# Altium schematic sheet Power_Stage.SchDoc
size A3; SheetNumber: 1; SheetTotal: 8
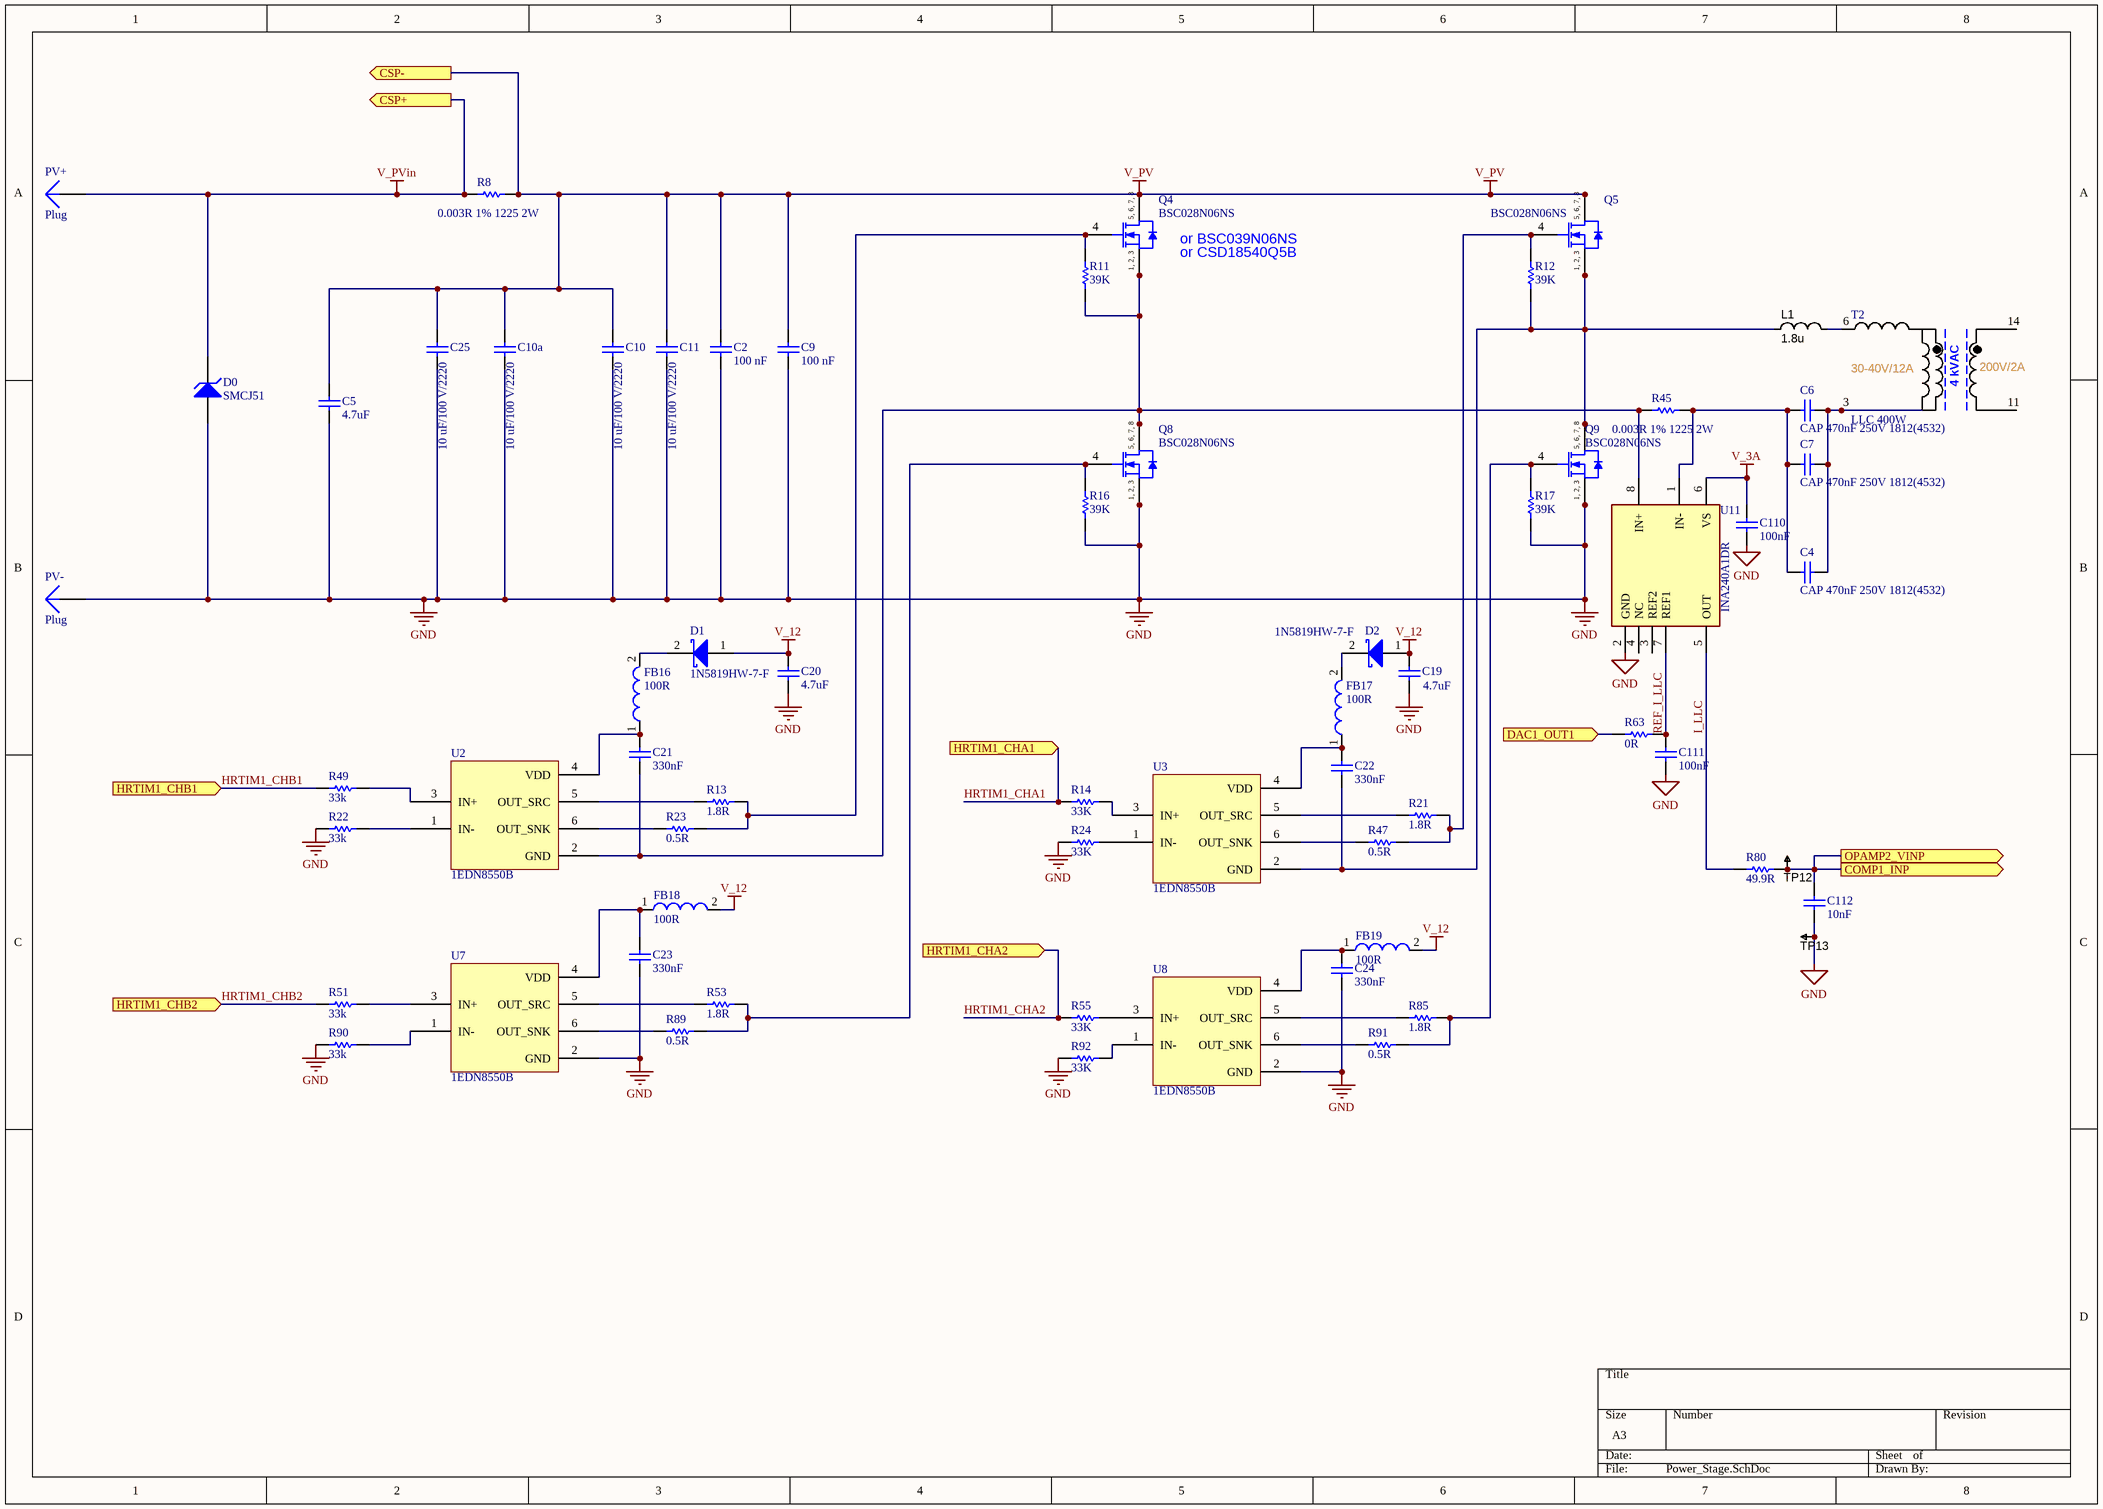
[diagram p0: Power_Stage.SchDoc]

## Parts
C2  100 nF  [CAPC2013X94X50NL20T25]
C4  CAP 470nF 250V 1812(4532)  [CAPC1812(4532)190_M]
C5  4.7uF  [CAPC3225X279X50NL20T25]
C6  CAP 470nF 250V 1812(4532)  [CAPC1812(4532)190_M]
C7  CAP 470nF 250V 1812(4532)  [CAPC1812(4532)190_M]
C9  100 nF  [CAPC2013X94X50NL20T25]
C10  10 uF/100 V/2220  [CAPC5750X279X64LL40T39]
C10a  10 uF/100 V/2220  [CAPC5750X279X64LL40T39]
C11  10 uF/100 V/2220  [CAPC5750X279X64LL40T39]
C19  Capacitance: 4.7uF  [CAPC3216X180X50ML20T25]  (hidden comment: C1206C105K3RACTU)
C20  Capacitance: 4.7uF  [CAPC3216X180X50ML20T25]  (hidden comment: C1206C105K3RACTU)
C21  330nF  [CAPC2013X135X45ML10T25]
C22  330nF  [CAPC2013X135X45ML10T25]
C23  330nF  [CAPC2013X135X45ML10T25]
C24  330nF  [CAPC2013X135X45ML10T25]
C25  10 uF/100 V/2220  [CAPC5750X279X64LL40T39]
C110  100nF  [CAPC1608X90X35NL10T15]
C111  100nF  [CAPC1608X90X35NL10T15]
C112  10nF  [CAPC1005X56X25NL10T15]
D0  SMCJ51  [FAIR-DO-214AB-2_V]
D1  1N5819HW-7-F  [DIOD-SOD-123-2_V]
D2  1N5819HW-7-F  [DIOD-SOD-123-2_V]
FB16  100R  [SMD-0603]
FB17  100R  [SMD-0603]
FB18  100R  [SMD-0603]
FB19  100R  [SMD-0603]
L1  1.8u  [IND LLC]
PV+  Plug  [PV_PAD]
PV-  Plug  [PV_PAD]
Q4  BSC028N06NS  [INF-PG-TDSON-8-1_V]
Q5  BSC028N06NS  [INF-PG-TDSON-8-1_V]
Q8  BSC028N06NS  [INF-PG-TDSON-8-1_V]
Q9  BSC028N06NS  [INF-PG-TDSON-8-1_V]
R8  0.003R 1% 1225 2W  [RESC3264X06N]
R11  39K  [RESC1608X55X30NL20T10]
R12  39K  [RESC1608X55X30NL20T10]
R13  1.8R  [RESC3216X70X40ML20T20]
R14  33K  [RESC1608X55X25ML10T15]
R16  39K  [RESC1608X55X30NL20T10]
R17  39K  [RESC1608X55X30NL20T10]
R21  1.8R  [RESC3216X70X40ML20T20]
R22  33k  [RESC1608X55X25ML10T15]
R23  0.5R  [RESC3216X70X40ML20T20]
R24  33K  [RESC1608X55X25ML10T15]
R45  0.003R 1% 1225 2W  [RESC3264X06N]
R47  0.5R  [RESC3216X70X40ML20T20]
R49  33k  [RESC1608X55X25ML10T15]
R51  33k  [RESC1608X55X25ML10T15]
R53  1.8R  [RESC3216X70X40ML20T20]
R55  33K  [RESC1608X55X25ML10T15]
R63  0R  [RESC1608X55X25ML10T15]
R80  49.9R  [RESC1608X55X30ML15T15]
R85  1.8R  [RESC3216X70X40ML20T20]
R89  0.5R  [RESC3216X70X40ML20T20]
R90  33k  [RESC1608X55X25ML10T15]
R91  0.5R  [RESC3216X70X40ML20T20]
R92  33K  [RESC1608X55X25ML10T15]
T2  LLC 400W  [ETD39-K-V-16P-HORIZONTAL-PRI]
TP12  TESTPOINT  [TP-R60]  (value not drawn)  (no BOM)
TP13  TESTPOINT  [TP-R60]  (value not drawn)  (no BOM)
U2  1EDN8550B  [SOT23-6]
U3  1EDN8550B  [SOT23-6]
U7  1EDN8550B  [SOT23-6]
U8  1EDN8550B  [SOT23-6]
U11  INA240A1DR  [SOIC127P600X175-8AN]

## Ports
COMP1_INP (out), CSP+ (out), CSP- (out), DAC1_OUT1 (in), HRTIM1_CHA1 (in), HRTIM1_CHA2 (in), HRTIM1_CHB1 (in), HRTIM1_CHB2 (in), OPAMP2_VINP (out)

## Nets
GND: C2.1 C5.1 C9.1 C10.1 C10a.1 C11.1 C19.1 C20.1 C23.1 C24.1 C25.1 C110.1 C111.1 C112.1 D0.1(A) PV-.1 Q8.1(SOURCE) Q8.2(SOURCE) Q8.3(SOURCE) Q9.1(SOURCE) Q9.2(SOURCE) Q9.3(SOURCE) R16.1 R17.1 R22.1 R24.1 R90.1 R92.1 TP13.1 U7.2(GND) U8.2(GND) U11.2(GND)
V_3A: C110.2 U11.6(VS)
V_12: C19.2 C20.2 D1.1(A) D2.1(A) FB18.2 FB19.2
V_PV: C2.2 C5.2 C9.2 C10.2 C10a.2 C11.2 C25.2 Q4.5(DRAIN) Q4.6(DRAIN) Q4.7(DRAIN) Q4.8(DRAIN) Q5.5(DRAIN) Q5.6(DRAIN) Q5.7(DRAIN) Q5.8(DRAIN) R8.2 ; port CSP-
V_PVin: D0.2(K) PV+.1 R8.1 ; port CSP+
COMP1_INP: C112.2 R80.2 TP12.1 ; port OPAMP2_VINP, port COMP1_INP
DAC1_OUT1: R63.1 ; port DAC1_OUT1
HRTIM1_CHA1: R14.1 ; port HRTIM1_CHA1
HRTIM1_CHA2: R55.1 ; port HRTIM1_CHA2
HRTIM1_CHB1: R49.1 ; port HRTIM1_CHB1
HRTIM1_CHB2: R51.1 ; port HRTIM1_CHB2
I_LLC: R80.1 U11.5(OUT)
REF_I_LLC: C111.2 R63.2 U11.7(REF1)
NetC4_1: C4.1 C6.1 C7.1 R45.2 U11.1(IN-)
NetC4_2: C4.2 C6.2 C7.2 T2.3
NetC21_1: C21.1 Q4.1(SOURCE) Q4.2(SOURCE) Q4.3(SOURCE) Q8.5(DRAIN) Q8.6(DRAIN) Q8.7(DRAIN) Q8.8(DRAIN) R11.1 R45.1 U2.2(GND) U11.8(IN+)
NetC21_2: C21.2 FB16.1 U2.4(VDD)
NetC22_1: C22.1 L1.1 Q5.1(SOURCE) Q5.2(SOURCE) Q5.3(SOURCE) Q9.5(DRAIN) Q9.6(DRAIN) Q9.7(DRAIN) Q9.8(DRAIN) R12.1 U3.2(GND)
NetC22_2: C22.2 FB17.1 U3.4(VDD)
NetC23_2: C23.2 FB18.1 U7.4(VDD)
NetC24_2: C24.2 FB19.1 U8.4(VDD)
NetD1_2: D1.2(K) FB16.2
NetD2_2: D2.2(K) FB17.2
NetL1_2: L1.2 T2.6
NetQ4_4: Q4.4(GATE) R11.2 R13.2 R23.2
NetQ5_4: Q5.4(GATE) R12.2 R21.2 R47.2
NetQ8_4: Q8.4(GATE) R16.2 R53.2 R89.2
NetQ9_4: Q9.4(GATE) R17.2 R85.2 R91.2
NetR13_1: R13.1 U2.5(OUT_SRC)
NetR14_2: R14.2 U3.3(IN+)
NetR21_1: R21.1 U3.5(OUT_SRC)
NetR22_2: R22.2 U2.1(IN-)
NetR23_1: R23.1 U2.6(OUT_SNK)
NetR24_2: R24.2 U3.1(IN-)
NetR47_1: R47.1 U3.6(OUT_SNK)
NetR49_2: R49.2 U2.3(IN+)
NetR51_2: R51.2 U7.3(IN+)
NetR53_1: R53.1 U7.5(OUT_SRC)
NetR55_2: R55.2 U8.3(IN+)
NetR85_1: R85.1 U8.5(OUT_SRC)
NetR89_1: R89.1 U7.6(OUT_SNK)
NetR90_2: R90.2 U7.1(IN-)
NetR91_1: R91.1 U8.6(OUT_SNK)
NetR92_2: R92.2 U8.1(IN-)

Not connected (* = marked no-connect by the designer): T2 11 14; U11 3(REF2) 4(NC)

## Notes on the sheet
- (near Q4) or BSC039N06NS
- (near Q4) or CSD18540Q5B
- (in symbol CMP-1091-00043-1) 5, 6, 7, 8; 1, 2, 3
- (in symbol TI-ETD39-200V-2A-LLC) 30-40V/12A; 200V/2A; 4 kVAC

## Library data of the parts
C2 C9 = CMP-1036-04427-2: X7R 100nF ±10% 100V 0805 Multilayer Ceramic Capacitors MLCC - SMD/SMT ROHS; Manufacturer: AVX Interconnect / Elco; Part Number: 08051C104JAT2A; Manufacturer Part Number: CL21B104KCFNNNE; Tolerance: 5%; Dissipation Factor: 2.5%; Supplier 1: RSComponents; Supplier Part Number 1: 1356664; RoHS: Yes; Category: Ceramic Capacitors; Stock 1: 1; Pricing 1: 100=0.13700, 500=0.12500, 1000=0.11100 (USD); Mount: Surface Mount; Case/Package: 0805; Number of Pins: 2; Case Code (Metric): 2012; Case Code (Imperial): 0805; Min Operating Temperature: -55°C; Max Operating Temperature: 125°C; Package Quantity: 1; Capacitance: 100nF; Voltage Rating: 100V; Packaging: Tape and Reel; Voltage Rating (DC): 100V; Dielectric: X7R; Series: -; Termination: SMD/SMT; Construction: Flat; Voltage: 100V; Length: 2.01mm; Width: 0.049inch; Height: 1.4mm; Thickness: 0.055inch; Depth: 1.25mm; Radiation Hardening: No; RoHS Compliant: Yes; REACH SVHC: No SVHC; Lead Free: Lead Free; ComponentLink1URL: https://datasheet.ciiva.com/152/cx7r-152288.pdf?src-supplier=Digi-Key; ComponentLink1Description: https://datasheet.ciiva.com/152/cx7r-152288.pdf?src-supplier=Digi-Key; ComponentLink2URL: https://datasheet.ciiva.com/152/cx7r-152289.pdf?src-supplier=Digi-Key; ComponentLink2Description: https://datasheet.ciiva.com/152/cx7r-152289.pdf?src-supplier=Digi-Key; ComponentLink3URL: https://datasheet.ciiva.com/11504/cx7r-11504232.pdf?src-supplier=Avnet; ComponentLink3Description: https://datasheet.ciiva.com/11504/cx7r-11504232.pdf?src-supplier=Avnet; ComponentLink4URL: https://datasheet.ciiva.com/16326/cx7r-16326744.pdf?src-supplier=Future+Electronics; ComponentLink4Description: https://datasheet.ciiva.com/16326/cx7r-16326744.pdf?src-supplier=Future+Electronics; ComponentLink5URL: https://datasheet.ciiva.com/22676/1679506-22676600.pdf?src-supplier=Element14; ComponentLink5Description: https://datasheet.ciiva.com/22676/1679506-22676600.pdf?src-supplier=Element14; ComponentLink6URL: https://datasheet.ciiva.com/5427/cx7r-218113-5427354.pdf?src-supplier=Mouser; ComponentLink6Description: https://datasheet.ciiva.com/5427/cx7r-218113-5427354.pdf?src-supplier=Mouser; ComponentLink7URL: https://datasheet.ciiva.com/16625/cx7r-16625228.pdf?src-supplier=Avnet+Europe; ComponentLink7Description: https://datasheet.ciiva.com/16625/cx7r-16625228.pdf?src-supplier=Avnet+Europe; ComponentLink8URL: https://datasheet.ciiva.com/152/cx7r-152287.pdf?src-supplier=Digi-Key; ComponentLink8Description: https://datasheet.ciiva.com/152/cx7r-152287.pdf?src-supplier=Digi-Key; ComponentLink9URL: https://datasheet.ciiva.com/28613/1679506-28613087.pdf?src-supplier=Element14; ComponentLink9Description: https://datasheet.ciiva.com/28613/1679506-28613087.pdf?src-supplier=Element14; JLCPCB Part #: C28233; Parameter 1: *
C4 C6 C7 = CMP-1040-01559-1: CAP 470nF 250V ±10% 1812 (4532 Metric) Thickness 1.9mm SMD; Case-Metric: 4532; Case-EIA: 1812; Tolerance: Â±10%; Max Thickness: 1.9 mm; Technology: SMT; Rated Voltage: 250 V; Value: 470nF; Parameter 1: *; JLCPCB Part #: *
C5 = CMP-2000-05478-1: Ceramic Capacitor, 100 V, 4.7 uF, +/-10%, -55 to 85 degC, 2-Pin SMD (1210), RoHS, Tape and Reel; Temperature Coefficient / Code: +/-15%; Case Height: 2.79mm; Brand: AVX; Case Width: 2.5mm; Tolerance: 10%; Capacitance: 22uF; Voltage Rating: 25V; Dielectric: X5R; Case Length: 3.2mm; Type: StandardX5RMLCCs; Case Code - in: 1210; Packaging: Reel; Minimum Operating Temperature: -55C; Package Reference: 1210; Product Category: MultilayerCeramicCapacitorsMLCC-SMD/SMT; Package / Case: 1210(3225metric); Dimensions: 2.5mmWx3.2mmLx2.79mmH; RoHS: Details; Manufacturer: AVX; Case Code - mm: 3225; Maximum Operating Temperature: +85C; Operating Temperature Range: -55Cto+85C; Mounting Technology: SurfaceMount; Product: GeneralTypeMLCCs; Manufacturer URL: http://www.avx.com/; Termination Style: SMD/SMT; Package Description: 2-Pin Surface Mount Device, Body 3.2 x 2.5 mm; Datasheet URL: http://datasheets.avx.com/cx5r.pdf; Datasheet Version: 05/2016; Voltage Rating DC: 25V; Factory Pack Quantity: 1000; Parameter 1: *; JLCPCB Part #: *
C10 C10a C11 C25 = CMP-2000-07534-1: Chip Capacitor, 10 uF, +/- 20%, 100 V, -55 to 125 degC, 2220 (5750 Metric), RoHS, Tape and Reel; Manufacturer: AVX; Manufacturer Part Number: 22201C106MAT2A; Capacitance: 10uF; Voltage Rating: 100V; Dielectric: X7R; Datasheet URL: http://datasheets.avx.com/X7RDielectric.pdf; Package Reference: 2220; Package Description: 2-Pin Surface Mount Device, Body 5 x 5.7 mm; Datasheet Version: 03/2017; Manufacturer URL: http://www.avx.com/; Mounting Technology: SurfaceMount; Supplier 1: Digi-Key; Supplier Part Number 1: 478-9622-1-ND; Stock 1: 129916; Pricing 1: 1=2,26000, 10=1,82600, 100=1,39470 (USD); RoHS: Yes; Mount: Surface Mount; Case/Package: 2220; Case Code (Metric): 5750; Case Code (Imperial): 2220; Min Operating Temperature: -55°C; Max Operating Temperature: 125°C; Packaging: Tape and Reel; Tolerance: 20%; Voltage Rating (DC): 100V; Length: 0.224inch; Width: 0.197inch; Thickness: 0.11inch; ComponentLink1URL: http://catalogs.avx.com/SurfaceMount.pdf?src-supplier=Digi-Key; ComponentLink1Description: http://catalogs.avx.com/SurfaceMount.pdf?src-supplier=Digi-Key; Parameter 1: *; JLCPCB Part #: *
C19 C20 = CMP-2000-04991-1: X7R ±10% 50V 4.7uF 1206 Multilayer Ceramic Capacitors MLCC - SMD/SMT ROHS; Manufacturer: Kemet; Temperature Coefficient / Code: +/-15%; Voltage Rating DC: 25V; Capacitance - nF: 1000nF; Class: Class1; Case Length: 3.2mm; Type: SMDMLCCX7R6.3-250VDCCommericalGrade; Case Width: 1.6mm; Product: GeneralTypeMLCCs; Dielectric: X7R; Datasheet URL: https://ciiva.com/datasheet-click-18194173?src=ciiva&sig=6daff8c4; Operating Temperature Range: -55Cto+125C; Series: C1206C; RoHS: Details; Product Category: MultilayerCeramicCapacitorsMLCC-SMD/SMT; Manufacturer URL: http://www.kemet.com/; Minimum Operating Temperature: -55C; Dimensions: 1.6mmWx3.2mmLx1.6mmH; Termination Style: SMD/SMT; Brand: Kemet; Packaging: Reel; Package / Case: 1206(3216metric); Case Code - mm: 3216; Datasheet Version: Jul-14; Factory Pack Quantity: 2000; Package Description: 2-Pin Surface Mount Device, Body 3.2 x 1.6 mm; Tolerance: 10%; Package Reference: 1206; Case Height: 1.6mm; Case Code - in: 1206; Maximum Operating Temperature: +125C; Voltage Rating: 25V; Parameter 1: *; JLCPCB Part #: C29823
C21-C24 = CMP-2100-03644-1: X7R ±10% 50V 330nF 0805 Multilayer Ceramic Capacitors MLCC - SMD/SMT ROHS; Manufacturer: Murata; Manufacturer Part Number: GRM21BR71H104KA01L; Capacitance: 100nF; Insulation Resistance: 10GR; Package Description: 2-Pin Surface Mount Device, Body 2 x 1.25 mm; Manufacturer URL: http://www.murata.com/; Case Code (Imperial): 0805; Voltage: 50V; Datasheet URL: http://psearch.en.murata.com/capacitor/product/GRM21BR71H104KA01%23.pdf; Termination: SMD/SMT; Lead Free: LeadFree; Package Quantity: 1; Mount: SurfaceMount; REACH SVHC: Unknown; Thickness: 0.053inch; Height: 1.25mm; Case/Package: 0805; Voltage Rating: 50V; Dielectric Material: Ceramic; Width: 0.049inch; Case Code (Metric): 2012; Material: Ceramic; Min Operating Temperature: -55degC; RoHSCompliant: true; Datasheet Version: 42675.0; Voltage Rating (DC): 50V; Tolerance: 10%; Dielectric: X7R; Package Reference: 0805; Depth: 1.25mm; Length: 2mm; Max Operating Temperature: 125degC; Packaging: TapeandReel; Number of Pins: 2; Radiation Hardening: No; Supplier 1: Farnell; Supplier Part Number 1: 2408531; RoHS: Yes; Category: Ceramic Capacitors; Stock 1: 576000; ComponentLink1URL: https://datasheet.ciiva.com/11786/0900766b8003061f-11786305.pdf?src-supplier=RSComponents; ComponentLink1Description: https://datasheet.ciiva.com/11786/0900766b8003061f-11786305.pdf?src-supplier=RSComponents; ComponentLink2URL: https://datasheet.ciiva.com/20173/71-2024-20173169.pdf?src-supplier=Rapid+Electronics; ComponentLink2Description: https://datasheet.ciiva.com/20173/71-2024-20173169.pdf?src-supplier=Rapid+Electronics; ComponentLink3URL: https://datasheet.ciiva.com/29200/453120-da-01-en-vs-kondensator-0805-29200537.pdf?src-supplier=Conrad; ComponentLink3Description: https://datasheet.ciiva.com/29200/453120-da-01-en-vs-kondensator-0805-29200537.pdf?src-supplier=Conrad; ComponentLink4URL: https://datasheet.ciiva.com/132/partnumbering-e-01-132209.pdf?src-supplier=Digi-Key; ComponentLink4Description: https://datasheet.ciiva.com/132/partnumbering-e-01-132209.pdf?src-supplier=Digi-Key; ComponentLink5URL: https://datasheet.ciiva.com/132/partnumbering-e-01-132210.pdf?src-supplier=Digi-Key; ComponentLink5Description: https://datasheet.ciiva.com/132/partnumbering-e-01-132210.pdf?src-supplier=Digi-Key; ComponentLink6URL: https://datasheet.ciiva.com/132/partnumbering-e-01-132211.pdf?src-supplier=Digi-Key; ComponentLink6Description: https://datasheet.ciiva.com/132/partnumbering-e-01-132211.pdf?src-supplier=Digi-Key; ComponentLink7URL: https://datasheet.ciiva.com/7937/1794405-7937708.pdf?src-supplier=Element14; ComponentLink7Description: https://datasheet.ciiva.com/7937/1794405-7937708.pdf?src-supplier=Element14; ComponentLink8URL: https://datasheet.ciiva.com/7937/1794405-7937709.pdf?src-supplier=Element14; ComponentLink8Description: https://datasheet.ciiva.com/7937/1794405-7937709.pdf?src-supplier=Element14; ComponentLink9URL: https://datasheet.ciiva.com/28534/1769893-28534317.pdf?src-supplier=Element14; ComponentLink9Description: https://datasheet.ciiva.com/28534/1769893-28534317.pdf?src-supplier=Element14; ComponentLink10URL: https://datasheet.ciiva.com/7937/4360-7937710.pdf?src-supplier=Element14; ComponentLink10Description: https://datasheet.ciiva.com/7937/4360-7937710.pdf?src-supplier=Element14; Parameter 1: *; JLCPCB Part #: C1740
C110 C111 = CAP: X7R 100nF ±10% 50V 0603 Multilayer Ceramic Capacitors MLCC - SMD/SMT ROHS; Part Number: GCM188R72A104KA64D; Manufacturer: Murata; Manufacturer Part Number: CC0603KRX7R9BB104; Voltage Rating: 100V; Supplier 1: Arrow Electronics; Supplier Part Number 1: GCM188R72A104KA64D; RoHS: Yes; Category: Ceramic Capacitors; Mount: Surface Mount; Case/Package: 0603; Case Code (Imperial): 0603; Case Code (Metric): 1608; Min Operating Temperature: -55°C; Max Operating Temperature: 125°C; Tolerance: 10%; Packaging: Tape and Reel; Capacitance: 100nF; Dielectric: X7R; Termination: SMD/SMT; Voltage Rating (DC): 100V; Length: 1.6mm; Height: 0.8mm; Depth: 0.8mm; Radiation Hardening: No; ComponentLink1URL: https://datasheet.ciiva.com/17451/product-17451047.pdf?src-supplier=Avnet+Europe; ComponentLink1Description: https://datasheet.ciiva.com/17451/product-17451047.pdf?src-supplier=Avnet+Europe; ComponentLink2URL: https://datasheet.ciiva.com/26889/getdatasheetpartid-387765-26889164.pdf?src-supplier=Verical; ComponentLink2Description: https://datasheet.ciiva.com/26889/getdatasheetpartid-387765-26889164.pdf?src-supplier=Verical; Parameter 1: *; JLCPCB Part #: C14663
C112 = CAP: X7R ±10% 50V 10nF 0603 Multilayer Ceramic Capacitors MLCC - SMD/SMT ROHS; Manufacturer: AVX Interconnect / Elco; Part Number: 04023C103JAT2A; Tolerance: 5%; Voltage Rating: 25V; Supplier 1: Digi-Key; Supplier Part Number 1: 478-7867-1-ND; Manufacturer Part Number: 04023C103JAT2A; RoHS: Yes; Category: Ceramic Capacitors; Stock 1: 9159; Pricing 1: 1=0.35000, 10=0.24300, 50=0.16980, 100=0.14560, 500=0.10920, 1000=0.09221, 2500=0.08735, 5000=0.08250 (USD); Mount: Surface Mount; Case/Package: 0402; Number of Pins: 2; Case Code (Imperial): 0402; Case Code (Metric): 1005; Min Operating Temperature: -55°C; Max Operating Temperature: 125°C; Packaging: Tape and Reel; Capacitance: 10nF; Package Quantity: 1; Voltage Rating (DC): 25V; Dielectric: X7R; Termination: SMD/SMT; Series: -; Construction: Flat; Length: 1mm; Width: 0.5mm; Thickness: 0.022inch; Depth: 0.5mm; Radiation Hardening: No; RoHS Compliant: Yes; Lead Free: Lead Free; ComponentLink1URL: https://datasheet.ciiva.com/11499/cx7r-11499815.pdf?src-supplier=Avnet; ComponentLink1Description: https://datasheet.ciiva.com/11499/cx7r-11499815.pdf?src-supplier=Avnet; ComponentLink2URL: https://datasheet.ciiva.com/5424/cx7r-218113-5424201.pdf?src-supplier=Mouser; ComponentLink2Description: https://datasheet.ciiva.com/5424/cx7r-218113-5424201.pdf?src-supplier=Mouser; ComponentLink3URL: https://datasheet.ciiva.com/7614/cx7r-7614730.pdf?src-supplier=Digi-Key; ComponentLink3Description: https://datasheet.ciiva.com/7614/cx7r-7614730.pdf?src-supplier=Digi-Key; ComponentLink4URL: https://datasheet.ciiva.com/208/cx7r-208205.pdf?src-supplier=Digi-Key; ComponentLink4Description: https://datasheet.ciiva.com/208/cx7r-208205.pdf?src-supplier=Digi-Key; ComponentLink5URL: https://datasheet.ciiva.com/14906/cx7r-14906237.pdf?src-supplier=Digi-Key; ComponentLink5Description: https://datasheet.ciiva.com/14906/cx7r-14906237.pdf?src-supplier=Digi-Key; ComponentLink6URL: https://datasheet.ciiva.com/16397/cx7r-16397645.pdf?src-supplier=Future+Electronics; ComponentLink6Description: https://datasheet.ciiva.com/16397/cx7r-16397645.pdf?src-supplier=Future+Electronics; ComponentLink7URL: https://datasheet.ciiva.com/14906/cx7r-14906238.pdf?src-supplier=Digi-Key; ComponentLink7Description: https://datasheet.ciiva.com/14906/cx7r-14906238.pdf?src-supplier=Digi-Key; Parameter 1: *; JLCPCB Part #: C57112
D0 = CMP-2000-07108-1: Transient Voltage Suppressor, 1500 W, 36 V, 2-Pin SMD, RoHS, Tape and Reel; Manufacturer: Fairchild Semiconductor; Breakdown Voltage-Max: 44.2V; Directional: Uni-Directional; Clamping Voltage-Max: 58.1V; Power Dissipation: 1500W; Breakdown Voltage-Min: 40V; Datasheet Version: Rev. 5.7, 09/2015; Mounting Technology: SurfaceMount; Package Description: 2-Pin Surface Mount Device, Body 6.875 x 5.9 mm; Package Reference: DO-214AB; Manufacturer URL: https://www.fairchildsemi.com/; Datasheet URL: https://www.fairchildsemi.com/datasheets/SM/SMCJ36A.pdf; Parameter 1: *; JLCPCB Part #: *
D1 D2 = CMP-0303-00003-1: 1.0 A Surface Mount Schottky Barrier Rectifier, 40 V, -65 to 125 degC, 2-Pin SOD-123 Package, RoHS, Tape and Reel; Manufacturer: Diodes Inc; @ VR (V): 40; @ Terminal Temperature TT (degC): 90; Maximum Average Rectified Current IO (A): 1; Total Capacitance CT (pF): 50; Peak Forward Surge Current IFSM (A): 25; Forward Voltage Drop VF (V): 0.45; VR (RMS) (V): 28; RoHS: TRUE; PartNumber: 1N5819HW-7-F; ComponentLink2URL: http://www.diodes.com/datasheets/ds30217.pdf; PackageDescription: 2-Pin SOD-123, Body 2.7 x 1.55 mm, Pitch 3.7 mm; @ IF (A): 1; Operating and Storage Temperature Range: -65 to 125 degC; ComponentLink1Description: Manufacturer URL; ComponentLink2Description: Datasheet; ComponentLink1URL: http://www.diodes.com/; Mounting Technology: Surface Mount; DatasheetVersion: Rev. 15-2; PackageReference: SOD-123-2; Maximum Reverse Current IR (uA): 50; Peak Repetitive Reverse Voltage VRRM (V): 40; Packing: Tape and Reel; Parameter 1: *; JLCPCB Part #: C8598
FB16-FB19 = CMP-0220-00115-1: SMD EMI Suppression Ferrite Bead WE-CBF, Z = 1500 Ohm; DatasheetVersion: Dec-2005; ComponentLink1URL: http://www.we-online.com; PackageVersion: 2009; PackageDescription: Chip Inductor, 2-Leads, Body 1.6 x 0.8 mm; ComponentLink2URL: http://www.we-online.de/katalog/media/pdf/742792691.pdf; ComponentLink1Description: Manufacturer Link; ComponentLink2Description: Datasheet; Impedance: 1500 Ohm; PackageReference: SMD-0603; Parameter 1: *; JLCPCB Part #: *
L1 = INDC_150n_1008: Inductor SMD chip 150nH 1008; Manufacturer 1: TDK Corporation; Manufacturer Part Number 1: NLV25T-R15J-PF; Ratings: 500 mA; Tolerance: ±5%; SCDType: spec; Package / Case: 1008 (2520 Metric); Supplier 1: Digi-Key; Supplier Part Number 1: 445-1715-1-ND; Value: 1.8u; Parameter 1: *; JLCPCB Part #: *
PV+ = Plug: System: Connector; LatestRevisionDate: 17-Jul-2002; LatestRevisionNote: Re-released for DXP Platform.; Publisher: Altium Limited; Parameter 1: *; JLCPCB Part #: *
Q4 Q5 Q8 Q9 = CMP-1091-00043-1: N-Channel OptiMOS Power-Transistor, 60 V VDS, 100 A ID, -55 to 150 degC, PG-TDSON-8-1, Reel, Green; PartNumber: BSC027N06LS5; Manufacturer: Infineon; Green: TRUE; ID (max): 100Â A; RthJA (max): 50 K/W; IDpuls (max): 400Â A; VGS(th) (min): 2.1Â V; Ptot (max): 83Â W; RthJC (max): 1.5Â K/W; VDS (max): 60Â V; Polarity: N; QG: 37Â nC; VGS(th) (max): 3.3 V; RDS (on) (max): 2.8Â mOhm; ComponentLink3Description: Package Specification; ComponentLink2URL: http://www.infineon.com/dgdl/BSC028N06NS_Rev2.1.pdf?folderId=db3a30431ddc9372011ebafa04517f8b&fileId=db3a3043345a30bc013465d221bd62f9; Packing: Reel; PackageReference: PG-TDSON-8-1; PackageDescription: 8-Pin Plastic (Green) Thin Dual Small Outline Non-Leaded Package, 5.15 x 5.9 mm Body, 1.27 mm Pitch; ComponentLink1Description: Manufacturer URL; ComponentLink1URL: http://www.infineon.com/; DatasheetVersion: Rev. 2.1; Mounting Technology: Surface Mount; ComponentLink2Description: Datasheet; ComponentLink3URL: http://www.infineon.com/cms/packages/SMD_-_Surface_Mounted_Devices/P-PG-TDSON/P-PG-TDSON-08-01x_2x_3.html?__locale=en; Halogen-free: TRUE; Rth: 1.5Â K/W; Parameter 1: *; JLCPCB Part #: *
R8 R45 = RES: RES SMD 3 MOHM 3W 2512 WIDE; Manufacturer: Susumu; Manufacturer Part Number: KRL6432E-M-R003-F-T1; Resistance: 3mR; Temperature Coefficient: 50ppm/°C; Supplier 1: Digi-Key; Supplier Part Number 1: 408-1613-1-ND; RoHS: Yes; Category: Chip SMD Resistors; Stock 1: 10436; Pricing 1: 1=0.96000, 10=0.85300, 25=0.78360, 50=0.71500, 100=0.61880, 250=0.52252, 500=0.44000 (USD); Case/Package: 2512; Weight: 0.001429oz; Case Code (Imperial): 2512; Case Code (Metric): 6432; Min Operating Temperature: -55°C; Max Operating Temperature: 155°C; Power Rating: 3W; Tolerance: 1%; Packaging: Tape and Reel; Package Quantity: 1000; Termination: SMD/SMT; Composition: Metal Foil; Length: 6.3mm; Height: 0.5mm; Width: 3.1mm; ComponentLink1URL: http://www.mouser.com/ds/2/392/n_catalog_partition19_en-1114600.pdf?src-supplier=Mouser; ComponentLink1Description: http://www.mouser.com/ds/2/392/n_catalog_partition19_en-1114600.pdf?src-supplier=Mouser; ComponentLink2URL: http://www.susumu-usa.com/pdf/Foot_Print_21.pdf?src-supplier=Digi-Key; ComponentLink2Description: http://www.susumu-usa.com/pdf/Foot_Print_21.pdf?src-supplier=Digi-Key; ComponentLink3URL: http://www.susumu.co.jp/common/pdf/n_catalog_partition19_en.pdf?src-supplier=Digi-Key; ComponentLink3Description: http://www.susumu.co.jp/common/pdf/n_catalog_partition19_en.pdf?src-supplier=Digi-Key; Parameter 1: *; JLCPCB Part #: *
R11 R12 R16 R17 = CMP-2000-01851-1: ±1% 39kΩ ±100ppm/℃ 0.1W 0603 Chip Resistor - Surface Mount ROHS; Part Number: RK73B1JTTD103J; Manufacturer: KOA Speer; Resistance: 10kR; Tolerance: 5%; Power Rating: 100mW; Temperature Coefficient: 200ppm/°C; Voltage Rating: 50V; Supplier 1: Digi-Key; Supplier Part Number 1: 2019-RK73B1JTTD103JCT-ND; Manufacturer Part Number: RK73B1JTTD103J; Stock 1: 652898; Pricing 1: 1=0,10000, 10=0,01500, 100=0,00610, 1000=0,00275, 2500=0,00239 (USD); RoHS: Yes; Case/Package: 0603; Number of Pins: 2; Case Code (Imperial): 0603; Case Code (Metric): 1608; Min Operating Temperature: -55°C; Max Operating Temperature: 155°C; Packaging: Tape and Reel; Composition: Thick Film; Termination: SMD/SMT; Military Standard: Not; Package Quantity: 5000; Voltage Rating (DC): 50V; Length: 1.6mm; Height: 0.45mm; Depth: 0.8mm; Width: 0.8mm; Lead Free: Lead Free; ComponentLink1URL: https://datasheet.ciiva.com/34302/1877832-34302947.pdf?src-supplier=Jameco; ComponentLink1Description: https://datasheet.ciiva.com/34302/1877832-34302947.pdf?src-supplier=Jameco; ComponentLink2URL: https://datasheet.ciiva.com/5554/rk73b-5554408.pdf?src-supplier=Mouser; ComponentLink2Description: https://datasheet.ciiva.com/5554/rk73b-5554408.pdf?src-supplier=Mouser; ComponentLink3URL: https://datasheet.ciiva.com/7773/548635-7773278.pdf?src-supplier=Element14; ComponentLink3Description: https://datasheet.ciiva.com/7773/548635-7773278.pdf?src-supplier=Element14; Parameter 1: *; JLCPCB Part #: C23153
R13 R21 R23 R47 R53 R85 R89 R91 = CMP-2003-00929-1: Manufacturer: KOA Speer; Part Number: RK73B2BTTD4R7J; Parameter 1: *; JLCPCB Part #: *
R14 R22 R24 R49 R51 R55 R90 R92 = CMP-2100-03663-1: Chip Resistor, 100 Ohm, +/- 1%, 0.1 W, -55 to 155 degC, 0603 (1608 Metric), RoHS, Tape and Reel; Manufacturer: Yageo; Manufacturer Part Number: RC0603FR-07100RL; Voltage Rating (DC): 50V; Power Rating: 100mW; Resistance: 100Ohm; Temperature Coefficient: 100ppm/degreesC; Number of Pins: 2; Tolerance: 1%; Height: 0.45mm; Manufacturer URL: http://www.yageo.com/; Military Standard: Not; Datasheet URL: http://www.yageo.com/NewPortal/yageodocoutput?fileName=/pdf/R-Chip/PYu-RC_Group_51_RoHS_L_5.pdf; Case Code (Imperial): 0603; Termination: SMD/SMT; Lead Free: LeadFree; Max Operating Temperature: 155degC; Case Code (Metric): 1608; RoHSCompliant: true; Voltage Rating: 50V; Width: 0.8mm; Composition: ThickFilm; Depth: 0.8mm; REACH SVHC: Unknown; Min Operating Temperature: -55degC; Packaging: TapeandReel; Package Description: 2-Pin Surface Mount Device, Body 1.6 x 0.8 mm; Length: 1.6mm; Package Reference: 0603; Datasheet Version: Rev. 5, 10/2016; Case/Package: 0603; Supplier 1: Digi-Key; Supplier Part Number 1: 311-100HRDKR-ND; RoHS: Yes; Category: Chip SMD Resistors; Stock 1: 21618328; Pricing 1: 1=0.10000, 10=0.02300, 100=0.00940, 1000=0.00421, 2500=0.00366 (USD); ComponentLink1URL: https://datasheet.ciiva.com/7660/38590-7660788.pdf?src-supplier=Element14; ComponentLink1Description: https://datasheet.ciiva.com/7660/38590-7660788.pdf?src-supplier=Element14; ComponentLink2URL: https://datasheet.ciiva.com/11808/0900766b80f96399-11808280.pdf?src-supplier=RSComponents; ComponentLink2Description: https://datasheet.ciiva.com/11808/0900766b80f96399-11808280.pdf?src-supplier=RSComponents; ComponentLink3URL: https://datasheet.ciiva.com/46440/1868787-46440890.pdf?src-supplier=Element14; ComponentLink3Description: https://datasheet.ciiva.com/46440/1868787-46440890.pdf?src-supplier=Element14; ComponentLink4URL: https://datasheet.ciiva.com/7746/1738695-7746237.pdf?src-supplier=Element14; ComponentLink4Description: https://datasheet.ciiva.com/7746/1738695-7746237.pdf?src-supplier=Element14; ComponentLink5URL: https://datasheet.ciiva.com/7746/1738695-7746238.pdf?src-supplier=Element14; ComponentLink5Description: https://datasheet.ciiva.com/7746/1738695-7746238.pdf?src-supplier=Element14; ComponentLink6URL: https://datasheet.ciiva.com/22747/443971-22747518.pdf?src-supplier=Element14; ComponentLink6Description: https://datasheet.ciiva.com/22747/443971-22747518.pdf?src-supplier=Element14; Parameter 1: *; JLCPCB Part #: *
R63 = CMP-2100-03667-1: ±1% 0Ω 0.1W 0603 Chip Resistor - Surface Mount ROHS; Manufacturer: Yageo; Temperature Coefficient: 200ppm/degreesC; Tolerance: 5%; Voltage Rating: 50V; Power Rating: 100mW; Resistance: 0mOhm; Width: 0.8mm; Max Operating Temperature: 155degC; Package Reference: 0603; Height: 0.45mm; Depth: 0.8mm; Package Description: 2-Pin Surface Mount Device, Body 1.6 x 0.8 mm; Termination: SMD/SMT; Package Quantity: 5000; Case/Package: 0603; Case Code (Imperial): 0603; Radiation Hardening: No; Number of Pins: 2; Length: 1.6mm; Lead Free: LeadFree; Voltage Rating (DC): 50V; Military Standard: Not; Datasheet URL: http://www.yageo.com/NewPortal/yageodocoutput?fileName=/pdf/R-Chip/PYu-RC_Group_51_RoHS_L_5.pdf; Manufacturer URL: http://www.yageo.com/; Packaging: TapeandReel; Case Code (Metric): 1608; Min Operating Temperature: -55degC; Composition: ThickFilm; RoHSCompliant: true; Contact Plating: Tin; Datasheet Version: Rev. 5, 10/2016; REACH SVHC: NoSVHC; Parameter 1: *; JLCPCB Part #: C21189
R80 = CMP-2000-00538-1: ±1% ±200ppm/℃ 0.1W 49.9Ω 0603 Chip Resistor - Surface Mount ROHS; Manufacturer: Panasonic; Part Number: ERJ-3EKF49R9V; Manufacturer Part Number: ERJ3EKF49R9V; Power Rating: 100mW; Voltage Rating: 75V; Temperature Coefficient: 100ppm/°C; Voltage Rating (DC): 50V; Working Voltage: 6V; Supplier 1: RSComponents; Supplier Part Number 1: 1229343; RoHS: Yes; Category: Chip SMD Resistors; Stock 1: 1; Pricing 1: 5000=0.00700 (USD); Mount: Surface Mount; Case/Package: 0603; Case Code (Imperial): 0603; Case Code (Metric): 1608; Contact Plating: Tin; Min Operating Temperature: -55°C; Max Operating Temperature: 155°C; Packaging: Tape and Reel; Resistance: 49.9R; Tolerance: 1%; Resistor Type: Thick Film; Number of Terminations: 2; Termination: SMD/SMT; Max Power Dissipation: 100mW; Series: ERJ; Package Quantity: 5000; Resistance Tolerance: 1%; Features: Automotive AEC-Q200; Construction: Rectangular; Technology: THICK FILM; Length: 1.6mm; Width: 0.8mm; Height: 0.022inch; Depth: 0.8mm; Radiation Hardening: No; REACH SVHC: Unknown; Lead Free: Lead Free; RoHS Compliant: Yes; Military Standard: Not; ComponentLink1URL: https://datasheet.ciiva.com/46388/1678782-46388908.pdf?src-supplier=Element14; ComponentLink1Description: https://datasheet.ciiva.com/46388/1678782-46388908.pdf?src-supplier=Element14; ComponentLink2URL: https://datasheet.ciiva.com/28694/1678782-28694219.pdf?src-supplier=Element14; ComponentLink2Description: https://datasheet.ciiva.com/28694/1678782-28694219.pdf?src-supplier=Element14; ComponentLink3URL: https://datasheet.ciiva.com/16772/70260748-16772570.pdf?src-supplier=Allied+Electronics; ComponentLink3Description: https://datasheet.ciiva.com/16772/70260748-16772570.pdf?src-supplier=Allied+Electronics; ComponentLink4URL: https://datasheet.ciiva.com/16766/70260748-16766262.pdf?src-supplier=Allied+Electronics; ComponentLink4Description: https://datasheet.ciiva.com/16766/70260748-16766262.pdf?src-supplier=Allied+Electronics; ComponentLink5URL: https://datasheet.ciiva.com/9117/aoa0000ce2-9117128.pdf?src-supplier=Avnet; ComponentLink5Description: https://datasheet.ciiva.com/9117/aoa0000ce2-9117128.pdf?src-supplier=Avnet; ComponentLink6URL: https://datasheet.ciiva.com/48531/aoa0000ce2-48531019.pdf?src-supplier=Avnet; ComponentLink6Description: https://datasheet.ciiva.com/48531/aoa0000ce2-48531019.pdf?src-supplier=Avnet; ComponentLink7URL: https://datasheet.ciiva.com/30095/aoa0000ce2-30095355.pdf?src-supplier=Onlinecomponents.com; ComponentLink7Description: https://datasheet.ciiva.com/30095/aoa0000ce2-30095355.pdf?src-supplier=Onlinecomponents.com; Parameter 1: *; JLCPCB Part #: C23185
T2 = TI-ETD39-200V-2A-LLC: Lr=1.9uH / Lm=10.2uH / n=5.7 / Vin=30-40V / Vout=200V; Parameter 1: *; JLCPCB Part #: *
TP12 TP13 = TESTPOINT: SMD test pin
U2 U3 U7 U8 = 1EDN8550B: Single-channel EiceDRIVER™ with true  differential inputs; Parameter 1: *; JLCPCB Part #: *
U11 = a9db4a8a3d73c22b64f8e8a0c239388: IC CURR SENSE 1 CIRCUIT 8SOIC; Slew Rate: 2V/µs; -3db Bandwidth: 400kHz; Input Bias Current: 90uA; Operating Supply Current: 1.8mA; Input Offset Voltage (Vos): 5uV; Number of Circuits: 1; Mount: Surface Mount; Packaging: Cut Tape; Max Operating Temperature: 125°C; Case/Package: SOIC; Min Operating Temperature: -40°C; RoHS Compliant: Yes; Number of Pins: 8; Parameter 1: *; JLCPCB Part #: *
PV- = Plug: LatestRevisionDate: 17-Jul-2002; LatestRevisionNote: Re-released for DXP Platform.; Publisher: Altium Limited; Parameter 1: *; JLCPCB Part #: *